# Altium schematic sheet LedAlert.SchDoc
size A
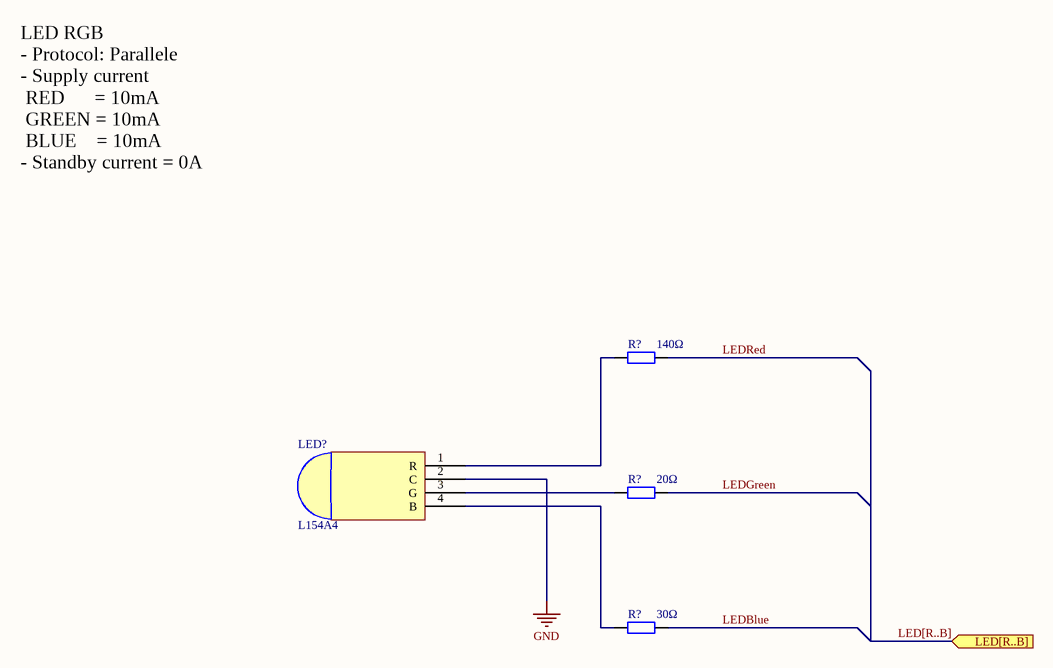
[diagram p0: LedAlert.SchDoc]

## Parts
(Parts that share a designator on the sheet are numbered #1, #2 ... from top to bottom, then left to right.)
LED?  L154A4
R?#1  140Ω  [AXIAL-0.4]
R?#2  20Ω  [AXIAL-0.4]
R?#3  30Ω  [AXIAL-0.4]

## Ports
LED[R..B] (in)

## Nets
GND: LED?.2(C)
LEDBlue: R?#3.1
LEDGreen: R?#2.1
LEDRed: R?#1.1
NetLED?_1: LED?.1(R) R?#1.2
NetLED?_3: LED?.3(G) R?#2.2
NetLED?_4: LED?.4(B) R?#3.2

## Buses and harness runs
bus LED[R..B] = port LED[R..B]

## Notes on the sheet
- LED RGB
  - Protocol: Parallele
  - Supply current
  RED      = 10mA
  GREEN = 10mA
  BLUE    = 10mA
  - Standby current = 0A

## Library data of the parts
LED? = Component_1
R?#1-R?#3 = Res2: Resistor; Value: 1K; Published: 8-Jun-2000; LatestRevisionDate: 17-Jul-2002; LatestRevisionNote: Re-released for DXP Platform.; PackageReference: AXIAL-0.4; Publisher: Altium Limited; PackageDescription: Axial Device, Thru-Hole; 2 Leads; 0.4 in Pin Spacing